# EAGLE schematic i10_SlideSwitch (EAGLE 7.2.0)
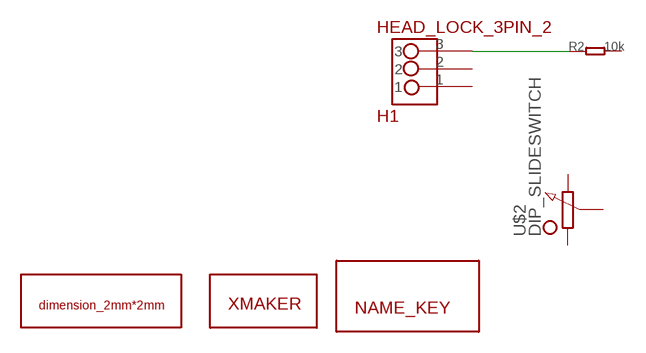
[diagram p0: schematic, sheet 1]

## Parts
H1  HEAD_LOCK_3PIN_2  [HEAD_LOCK_3PIN_2]
R2  10k  005-R0603  [0603]
U$1  XMAKERLOGO  [XMAKERLOGO]
U$2  DIP_SLIDESWITCH  [DIP_SLIDESWITCH]
U$3  NAME_KEY  [NAME_KEY]
U$4  DIMENSION_2MM2MM  [DIMENSION_2MM*2MM]
Unconnected: H1.1 H1.2 H1.3 R2.1 R2.2 U$2.1 U$2.2 U$2.3

## Library data of the parts
H1 = Xmaker:HEAD_LOCK_3PIN_2
R2 = Discrete:005-R*
U$1 = switch-tact:XMAKERLOGO
U$2 = Xmaker_yuhui:DIP_SLIDESWITCH
U$3 = Xmaker:NAME_KEY
U$4 = Xmaker:DIMENSION_2MM*2MM